# Altium schematic sheet Ethernet.SchDoc: Ethernet
size A4; Project: STM32H7-DK; Date: Not used; ApprovedBy: Not used; CheckedBy: Not used; Author: Not used; CompanyName: STMicroelectronics; DrawnBy: Not used; Engineer: Not used; Organization: Not used; Address1: Not used; Address2: Not used; Address3: Not used; Address4: Not used; DocumentNumber: Not used; Revision: Not used; SheetNumber: 8; SheetTotal: 16; CurrentTime: Not used; CurrentDate: Not used; Time: Not used; DocumentFullPathAndName: Not used; DocumentName: Not used; ModifiedDate: Not used; ImagePath: Not used; ProjectName: Not used; Application_BuildNumber: Not used
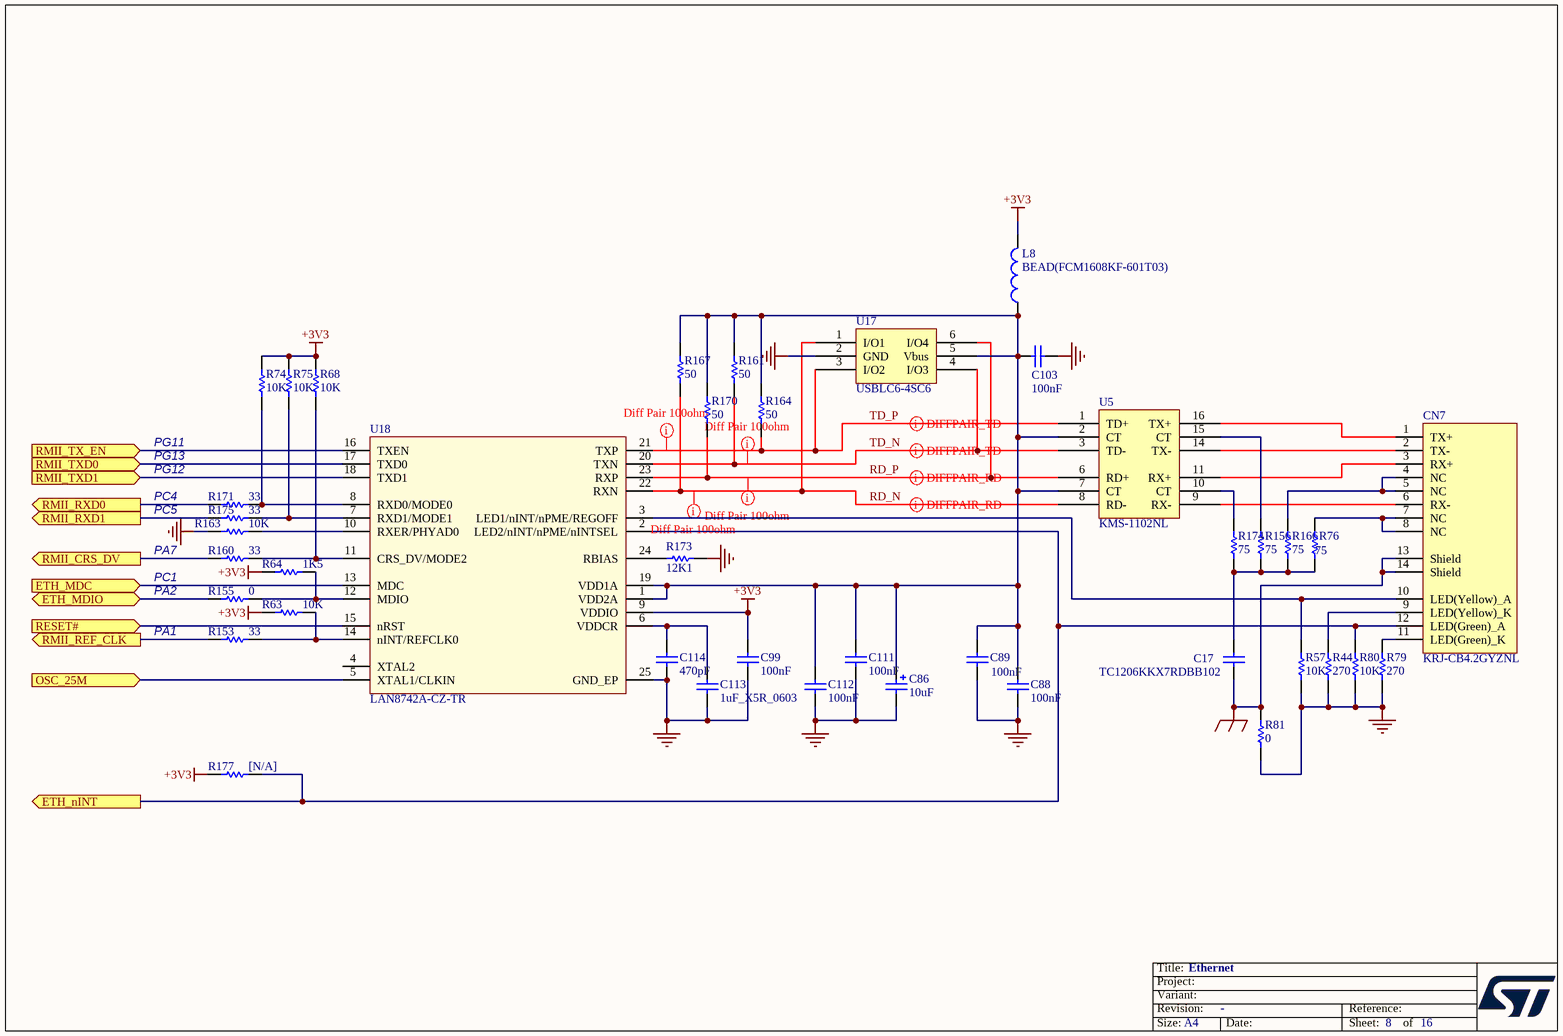
[diagram p0: Ethernet.SchDoc]

## Parts
C17  TC1206KKX7RDBB102  [1206C]
C86  10uF  [TAN-A]
C88  100nF  [0603C]
C89  100nF  [0603C]
C99  100nF  [0603C]
C103  100nF  [0603C]
C111  100nF  [0603C]
C112  100nF  [0603C]
C113  1uF_X5R_0603  [0603C]
C114  470pF  [0603C]
CN7  KRJ-CB4.2GYZNL  [RJ45_LED_KRJ-CB4R2GYZNL_EM]
L8  BEAD(FCM1608KF-601T03)  [0603L]
R44  270  [0603R]
R57  10K  [0603R]
R63  10K  [0603R]
R64  1K5  [0603R]
R68  10K  [0603R]
R74  10K  [0603R]
R75  10K  [0603R]
R76  75  [0603R]
R79  270  [0603R]
R80  10K  [0603R]
R81  0  [0805R]
R153  33  [0603R]
R155  0  [0603R]
R156  75  [0603R]
R160  33  [0603R]
R161  50  [0603R]
R163  10K  [0603R]
R164  50  [0603R]
R166  75  [0603R]
R167  50  [0603R]
R170  50  [0603R]
R171  33  [0603R]
R173  12K1  [0603R]
R174  75  [0603R]
R175  33  [0603R]
R177  [N/A]  [0603R]
U5  KMS-1102NL  [TF_16SM_12R7X9R65]
U17  USBLC6-4SC6  [SOT23-6]
U18  LAN8742A-CZ-TR  [QFN24_0R5_4X4]

## Ports
ETH_MDC (in), ETH_MDIO (bidir), ETH_nINT (out), OSC_25M (in), RESET# (in), RMII_CRS_DV (out), RMII_REF_CLK (out), RMII_RXD0 (out), RMII_RXD1 (out), RMII_TX_EN (in), RMII_TXD0 (in), RMII_TXD1 (in)

## Nets
+3V3: C99.2 L8.2 R63.1 R64.2 R68.1 R74.1 R75.1 R177.1 U18.9(VDDIO)
EGND: C17.1 CN7.13(Shield) CN7.14(Shield) R81.1
GND: C86.2 C88.1 C89.1 C99.1 C103.1 C111.1 C112.1 C113.2 C114.1 R44.2 R57.2 R79.2 R80.2 R81.2 R163.2 R173.2 U17.2(GND) U18.25(GND_EP)
ETH_MDC: U18.13(MDC) ; port ETH_MDC
ETH_MDIO: R155.2 ; port ETH_MDIO
ETH_nINT: CN7.12(LED(Green)_A) R80.1 R177.2 U18.2(LED2/nINT/nPME/nINTSEL) ; port ETH_nINT
OSC_25M: U18.5(XTAL1/CLKIN) ; port OSC_25M
RD_N: R167.1 U5.8(RD-) U17.1(I/O1) U18.22(RXN)
RD_P: R170.1 U5.6(RD+) U17.6(I/O4) U18.23(RXP)
RESET#: U18.15(nRST) ; port RESET#
RMII_CRS_DV: R160.2 ; port RMII_CRS_DV
RMII_REF_CLK: R153.2 ; port RMII_REF_CLK
RMII_RXD0: R171.2 ; port RMII_RXD0
RMII_RXD1: R175.2 ; port RMII_RXD1
RMII_TX_EN: U18.16(TXEN) ; port RMII_TX_EN
RMII_TXD0: U18.17(TXD0) ; port RMII_TXD0
RMII_TXD1: U18.18(TXD1) ; port RMII_TXD1
TD_N: R161.1 U5.3(TD-) U17.4(I/O3) U18.20(TXN)
TD_P: R164.1 U5.1(TD+) U17.3(I/O2) U18.21(TXP)
NetC17_2: C17.2 R76.1 R156.1 R166.1 R174.1
NetC86_1: C86.1 C88.2 C89.2 C103.2 C111.2 C112.2 L8.1 R161.2 R164.2 R167.2 R170.2 U5.2(CT) U5.7(CT) U17.5(Vbus) U18.1(VDD2A) U18.19(VDD1A)
NetC113_1: C113.1 C114.2 U18.6(VDDCR)
NetCN7_1: CN7.1(TX+) U5.16(TX+)
NetCN7_2: CN7.2(TX-) U5.14(TX-)
NetCN7_3: CN7.3(RX+) U5.11(RX+)
NetCN7_4: CN7.4(NC) CN7.5(NC) R166.2
NetCN7_6: CN7.6(RX-) U5.9(RX-)
NetCN7_7: CN7.7(NC) CN7.8(NC) R76.2
NetCN7_9: CN7.9(LED(Yellow)_K) R44.1
NetCN7_10: CN7.10(LED(Yellow)_A) R57.1 U18.3(LED1/nINT/nPME/REGOFF)
NetCN7_11: CN7.11(LED(Green)_K) R79.1
NetR63_2: R63.2 R153.1 U18.14(nINT/REFCLK0)
NetR64_1: R64.1 R155.1 U18.12(MDIO)
NetR68_2: R68.2 R160.1 U18.11(CRS_DV/MODE2)
NetR74_2: R74.2 R171.1 U18.8(RXD0/MODE0)
NetR75_2: R75.2 R175.1 U18.7(RXD1/MODE1)
NetR156_2: R156.2 U5.15(CT)
NetR163_1: R163.1 U18.10(RXER/PHYAD0)
NetR173_1: R173.1 U18.24(RBIAS)
NetR174_2: R174.2 U5.10(CT)

Not connected (* = marked no-connect by the designer): U18 4(XTAL2)

## Layout directives
differential pair: RD_N, RD_P, TD_N, TD_P
rule Matched Net Lengths [Tolerance = 100mil]: RD_N, RD_P, TD_N, TD_P

## Notes on the sheet
- PG11
- PG13
- PG12
- PC4
- PC5
- PA7
- PC1
- PA2
- PA1
- Title:
- Project:
- Size:
- Revision:
- Variant:
- A4
- -
- Date:
- Reference:
- Sheet:
- of

## Library data of the parts
C17 = Capacitor_ST: Capacitor 0402 / 0603 / 0805/ 1206; Value: 100nF; Revision: July-2002: Re-released for DXP Platform.
C86 = Cap_10uF_POL_10%_TANA: Polarized Capacitor,10uF,10V,10%,typeA,VISHAY; Manuf_Part_1: 293D106X9010A2TE3; Revision: July-2002: Re-released for DXP Platform.; Value: 10uF; Manuf_1: VISHAY; Order: *; ECCN_US/EU: n/a
C88 C89 C99 C103 C111 C112 = Capacitor_ST: Capacitor 0402 / 0603 / 0805; Revision: July-2002: Re-released for DXP Platform.; Value: 100nF
C113 = CAP SMD 0603  X5R 1礔 25V 10%: 0603  X5R 1礔; Rated voltage: 25V; Tolerance: 10%; Manufacturer: *; Manufacturer P/N: *; Order code Farnell: 1288202RL; Value: 1礔; Power: *; Technology: X5R; Temperature  Factor: *; Temperature Max: +125癈; Temperature Min: -55癈; STS Code: *
C114 = Capacitor_ST: Capacitor 0402 / 0603 / 0805; Value: 100nF; Revision: July-2002: Re-released for DXP Platform.
CN7 = KRJ-CB4.2GYZNL: 100 Base-TX (Fast Ethernet) SMD RJ45 single port (1x1) with LEDS Integrated Magnetics Connector; Manuf_1: DGKYD; ECCN_US/EU: EAR99/NEC; Ordered by: Subcon; Fitted: YES; Manuf_Part_1: KRJ-CB4.2GYZNL
L8 = Inductor: Value: 100uH; Published: 8-Jun-2000; Revision: July-2002: Re-released for DXP Platform.; Publisher: Altium Limited
R44 R79 = Resistor_ST: Resistor 0402 / 0603 / 0805; Value: 10K
R57 R63 R68 R74 R75 R80 R163 = Resistor_ST: Resistor 0402 / 0603 / 0805; Value: 10K
R64 = Res_1K5_1%_0402: Resistor,1K5,0402,1%,YAGEO; Value: 1K5; Manuf_1: YAGEO; ECCN_US/EU: n/a; Distrib: FARNELL
R76 R81 R156 R166 R174 = Res_75_1%_0603: Resistor,75,0603,1%,YAGEO; Manuf_1: YAGEO; Order: *; ECCN_US/EU: n/a; Distrib: FARNELL
  R76 R156 R166 R174: Value: 75
  R81: Value: 0
R153 R160 R171 R175 = Res_33_1%_0402: Resistor,33,0402,1%,YAGEO; Value: 33; Manuf_1: YAGEO; Order: *; ECCN_US/EU: n/a; Distrib: FARNELL
R155 = Res1: Resistor; Value: 1K; Published: 8-Jun-2000; Revision: July-2002: Re-released for DXP Platform.; Publisher: Altium Limited
R161 R164 R167 R170 = Res_50_1%_0603: Resistor,50,0603,1%,YAGEO; Value: 50; Manuf_1: YAGEO; Order: *; ECCN_US/EU: n/a; Distrib: FARNELL
R173 = Res_12K1_1%_0603: Resistor,12K1,0603,1%,VISHAY; Manuf_Part_1: MCT 0603-50 1% P5 12K1; Order: 2325243; Value: 12K1; ECCN_US/EU: n/a; Manuf_1: VISHAY; Distrib: FARNELL
R177 = res1: Resistor; Value: 1K; Ordered by: Subcon; ECCN_US/EU: NA; Fitted: NO; Published: 8-Jun-2000; Revision: July-2002: Re-released for DXP Platform.; Publisher: Altium Limited
U5 = KMS-1102NL: Manuf_1: DGKYD; Fitted: YES; Ordered by: Subcon; ECCN_US/EU: NA; Manuf_Part_1: KMS-1102NL
U17 = USBLC6-4SC6: Fitted: YES; Ordered by: STM; ECCN_US/EU: EAR99/NEC; Manuf_1: STM; Manuf_Part_1: USBLC6-4SC6
U18 = LAN8742A-CZ-TR: LAN8742A-CZ-TR - Small Footprint RMII 10/100 Ethernet, Transceiver with HP Auto-MDIX and flexPWR Technology SQFN-24; Manuf_1: MICROCHIP; Ordered by: Subcon; Fitted: YES; ECCN_US/EU: EAR99/NEC; Manuf_Part_1: LAN8742A-CZ-TR